# Altium project PIR Sensor driver v2.PrjPcb
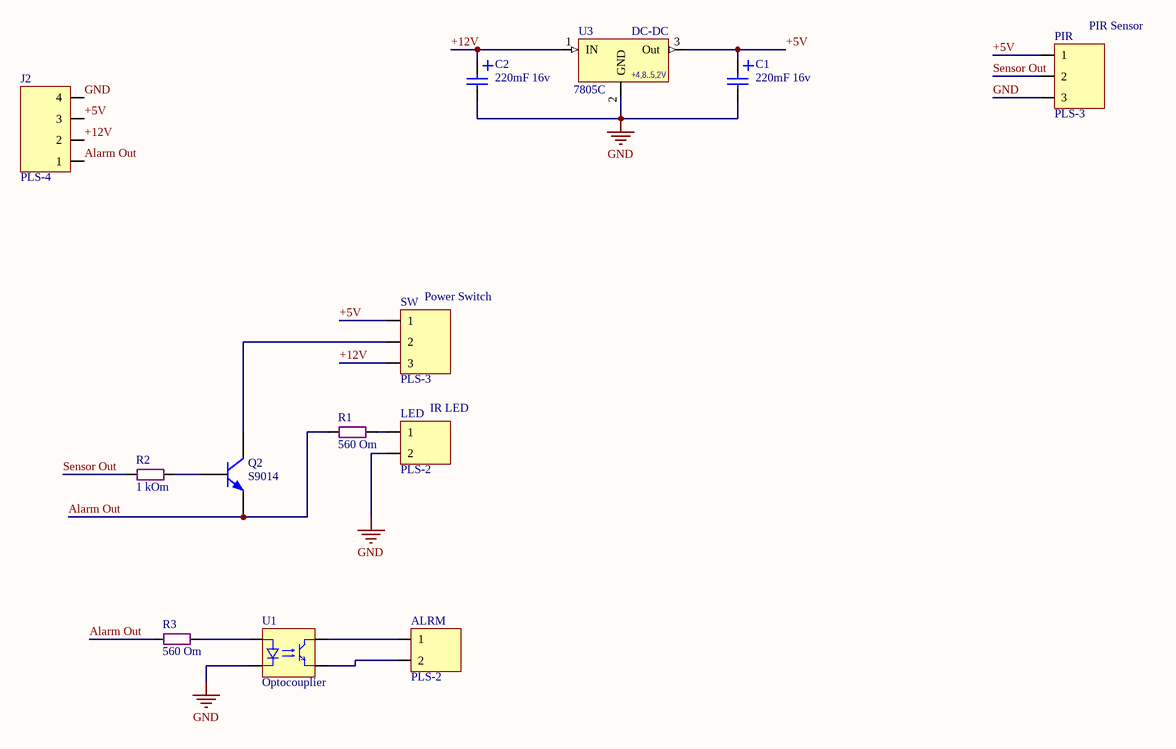
[diagram p0: PIR Sensor driver v2.SchDoc]
1 sheet, 13 parts. Net scope: global (net labels, ports and power ports of the same name join across sheets).
Board file: PIR Sensor driver v2.PcbDoc

## Sheet PIR Sensor driver v2.SchDoc
size A4

### Parts
ALRM  PLS-2  [Line 2.54 x 2]
C1  220mF 16v  [Cap E p4mm D6.5xH11]
C2  220mF 16v  [Cap E p2mm D6.5xH11]
J2  PLS-4  [Line 2.54 X 4]
LED  PLS-2  [Line 2.54 x 2]
PIR  PLS-3  [Line 2.54 X 3]
Q2  S9014  [TO-92 2.54 (EBC)]
R1  560 Om  [SMD 0805 (2012)]
R2  1 kOm  [SMD 0805 (2012)]
R3  560 Om  [SMD 0805 (2012)]
SW  PLS-3  [Line 2.54 X 3]
U1  Optocouplier  [DIP-4]
U3  7805C  V Out: +4,8..5,2V  [D-PAK]

### Nets
GND: C1.2 C2.2 J2.4 LED.2 PIR.3 U1.2 U3.2(GND)
+5V: C1.1 J2.3 PIR.1 SW.1 U3.3(Out)
+12V: C2.1 J2.2 SW.3 U3.1(IN)
Alarm Out: J2.1 Q2.E R1.1 R3.1
Sensor Out: PIR.2 R2.1
NetALRM_1: ALRM.1 U1.3
NetALRM_2: ALRM.2 U1.4
NetLED_1: LED.1 R1.2
NetQ2_B: Q2.B R2.2
NetQ2_C: Q2.C SW.2
NetR3_2: R3.2 U1.1

### Notes on the sheet
- (near U3) DC-DC
- (near PIR) PIR Sensor
- (near SW) Power Switch
- IR LED

### Library data of the parts
ALRM LED = PLS-2: Vert, Sgl line, Male
C1 C2 = Cap E 220mF x 16V: Capacitor; Value: 220mF 16v
J2 = PLS-4: Vert, Sgl line, Male
PIR SW = PLS-3: Vert, Sgl line, Male
Q2 = S9014: NPN Bipolar Transistor; Published: 8-Jun-2000; LatestRevisionNote: Re-released for DXP Platform.; PackageReference: TO-226-AA; Publisher: Altium Limited; PackageDescription: TO, Flat Index; 3 In-Line, Axial Leads; Body Dia. 4.8mm; Leads 0.55 x 0.51 mm (max)
R1-R3 = Res SMD 0805
U1 = Optocouplier LTV 817B: LTV817 Datasheet: http://lib.chipdip.ru/222/DOC000222300.pdf; Name: LTV817B
U3 = 7805C: Voltage Regulator; Manufacturer: Интеграл; I output (A): 1; Max Voltage In (V): 35; Напряжение выход-вход (dropout): >2V; t: -10..+70°C; Case: D2PAK; Shema: http://tec.org.ru/_bd/5/57349922.jpg; Name: 7805C